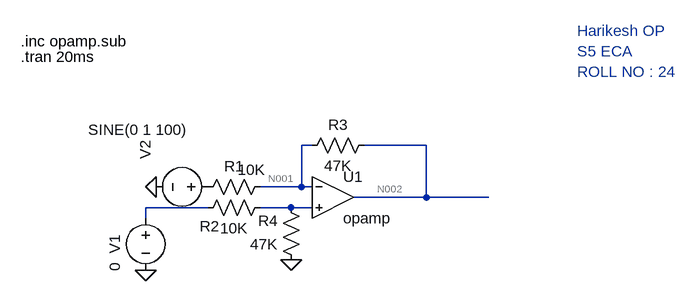
[diagram p0: schematic DIFFERENTIALAMP.asc]
DIFFERENTIALAMP.asc, the LTspice schematic file:
Version 4
SHEET 1 880 680
WIRE 48 208 32 208
WIRE 224 208 128 208
WIRE 32 272 32 208
WIRE 32 272 -32 272
WIRE 48 272 32 272
WIRE 224 288 224 208
WIRE 224 288 112 288
WIRE 320 288 224 288
WIRE -112 304 -208 304
WIRE 16 304 -32 304
WIRE 48 304 16 304
WIRE -208 320 -208 304
FLAG 16 384 0
FLAG -192 272 0
FLAG -208 400 0
SYMBOL OpAmps\\opamp 80 224 R0
SYMATTR InstName U1
SYMBOL res -16 256 R90
WINDOW 0 0 56 VBottom 2
WINDOW 3 -26 29 VTop 2
SYMATTR InstName R1
SYMATTR Value 10K
SYMBOL res -16 288 R90
WINDOW 0 60 93 VBottom 2
WINDOW 3 32 56 VTop 2
SYMATTR InstName R2
SYMATTR Value 10K
SYMBOL res 144 192 R90
WINDOW 0 0 56 VBottom 2
WINDOW 3 32 56 VTop 2
SYMATTR InstName R3
SYMATTR Value 47K
SYMBOL res 32 400 R180
WINDOW 0 36 76 Left 2
WINDOW 3 36 40 Left 2
SYMATTR InstName R4
SYMATTR Value 47K
SYMBOL voltage -208 304 R0
WINDOW 0 -32 56 VBottom 2
WINDOW 3 -63 91 VTop 2
WINDOW 123 0 0 Left 0
WINDOW 39 0 0 Left 0
SYMATTR InstName V1
SYMATTR Value 0
SYMBOL voltage -96 272 R90
WINDOW 0 -72 112 Left 2
WINDOW 3 -88 47 VRight 2
WINDOW 123 0 0 Left 0
WINDOW 39 0 0 Left 0
SYMATTR InstName V2
SYMATTR Value SINE(0 1 100)
TEXT 456 32 Left 2 ;Harikesh OP\nS5 ECA \nROLL NO : 24
TEXT -400 48 Left 2 !.inc opamp.sub
TEXT -400 72 Left 2 !.tran 20ms

The netlist it stands for:
* DIFFERENTIALAMP.asc
XU1 N001 N004 N002 opamp Aol=100K GBW=10Meg  ; pins invin noninvin out
R1 N001 P001 10K
R2 N004 N003 10K
R3 N002 N001 47K
R4 0 N004 47K
V1 N003 0 0
V2 P001 0 SINE(0 1 100)
* Harikesh OP
* S5 ECA
* ROLL NO : 24
.inc opamp.sub
.tran 20ms
.backanno
.end

* Results of the author's LTspice run, read from the files saved beside the schematic
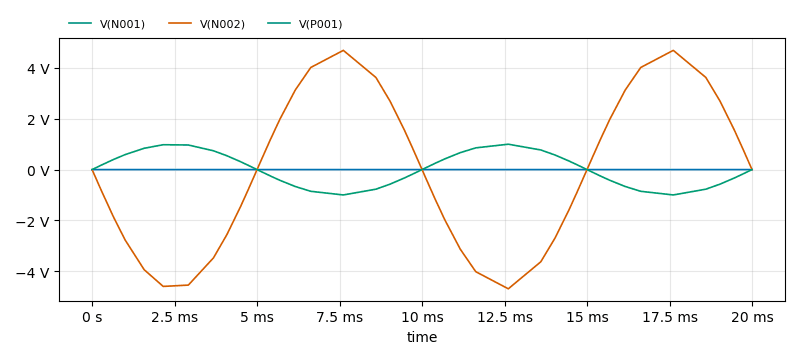
[diagram p1: Transient Analysis of DIFFERENTIALAMP.asc, plotted from the saved traces]
* Transient Analysis, 1 run:
*   V(N001): min -66.35 µV, max 66.35 µV, average 59.5 nV, rms 47.08 µV, last 46.99 µV
*   V(N002): min -4.683 V, max 4.683 V, average -6.285 mV, rms 3.27 V, last 267.9 µV
*   V(P001): min -996.6 mV, max 996.6 mV, average 1.337 mV, rms 695.9 mV, last 0 V